# EAGLE design Hall Effect Sensor (EAGLE 7.1.0)
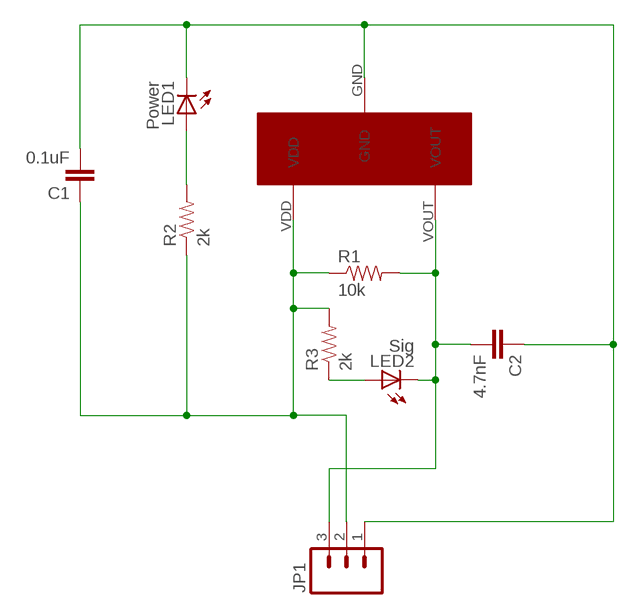
[diagram p0: schematic, sheet 1]

## Parts
C1  0.1uF  CAP0603-CAP  [0603-CAP]
C2  4.7nF  CAP0603-CAP  [0603-CAP]
JP1  M03PTH  [1X03]
LED1  Power  LED0603  [LED-0603]
LED2  Sig  LED0603  [LED-0603]
R1  10k  RESISTOR0603-RES  [0603-RES]
R2  2k  RESISTOR0603-RES  [0603-RES]
R3  2k  RESISTOR0603-RES  [0603-RES]
U$1  US5881-HALL-EFFECT  [US5881-HALL-EFFECT]

## Nets
N$2: C1.2 C2.1 JP1.1 LED1.C U$1.GND
N$3: C2.2 JP1.3 LED2.C R1.2 U$1.VOUT
N$6: LED1.A R2.2
N$7: LED2.A R3.1
VDD: C1.1 JP1.2 R1.1 R2.1 R3.2 U$1.VDD

## Library data of the parts
C1 C2 = SparkFun-Passives:CAP: Capacitor Standard 0603 ceramic capacitor, and 0.1" leaded capacitor.
JP1 = SparkFun-Connectors:M03: Header 3 Standard 3-pin 0.1" header. Use with straight break away headers (SKU : PRT-00116), right angle break away headers (PRT-00553), swiss pins (PRT-00743), machine pins (PRT-00117), and female headers (PRT-00115). Molex polarized connector foot print use with SKU : PRT-08232 with associated crimp pins and housings.
LED1 LED2 = SparkFun-LED:LED: LEDs Standard schematic elements and footprints for 5mm, 3mm, 1206, and 0603 sized LEDs. 5mm - Spark Fun Electronics SKU : COM-00529 (and others)
R1-R3 = SparkFun-Passives:RESISTOR: Resistor Basic schematic elements and footprints for 0603, 1206, and PTH resistors.
U$1 = TPS5430:US5881-HALL-EFFECT

## Board
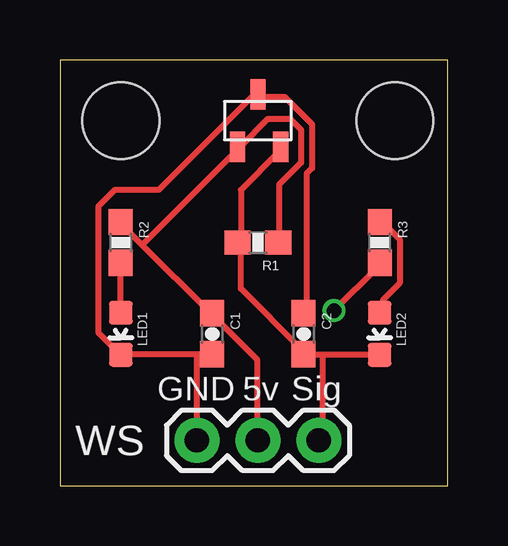
[diagram p1: board, top side]
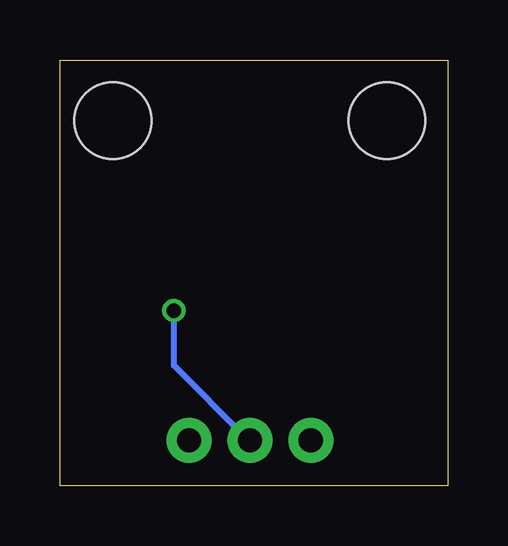
[diagram p2: board, bottom side, seen from below]

Size 16.18 x 17.77 mm. Coordinates in mm from the lower left corner, seen from the top.
Outline: 0,0 16.18,0 16.18,17.77 0,17.77 0,0
Copper layers (1*16): Top 0.0356mm / dielectric 1.5011mm / Bottom 0.0356mm
Design rules "LaenPCBOrder": minimum track width 6mil, minimum drill 13mil, track to track 6mil, track to pad 6mil, pad to pad 6mil, via to via 6mil, smd to smd 6mil, copper to edge 15mil, drill to drill 6mil, minimum pad ring 7mil, minimum via ring 7mil, stop-mask expansion 3mil, vias tented up to drill 0mil, thermal gap 10mil
Holes 3.2 mm at 2.54,15.24 13.97,15.24

### Footprints (pad centres in the part's own frame; a part is rotated, then mirrored left to right if it is on the bottom)
0603-CAP = smd 1.1 x 1: 1 -0.85,0; 2 0.85,0
1X03 = drill 1.016 pad 1.88: 1 0,0; 2 2.54,0; 3 5.08,0
LED-0603 = smd 1 x 1: A 0,-0.877; C 0,0.877
0603-RES = smd 1.1 x 1: 1 -0.85,0; 2 0.85,0
US5881-HALL-EFFECT = smd 0.635 x 1.27: GND 0,1.1; VDD -0.85,-1.1; VOUT 0.95,-1.1

### Placement (x,y rotation side)
C1  6.35,6.35 270 top
C2  10.16,6.35 270 top
JP1  5.71,1.91 0 top
LED1  2.54,6.35 180 top
LED2  13.34,6.35 180 top
R1  8.26,10.16 180 top
R2  2.54,10.16 270 top
R3  13.34,10.16 270 top
U$1  8.26,15.24 0 top

### Tracks (layer width: path | path; a pad name or v marks a point on that pad's centre or on a via)
N$2
  Top 0.254: 5.71,5.49 6.17,5.49 C1.2 | 5.71,5.49 2.74,5.49 LED1.C 2.52,5.49 1.6,6.4 1.6,11.66 2.29,12.34 4.12,12.34 8.23,16.46 U$1.GND 8.46,16.23 9.37,16.23 10.52,15.09 10.52,13.26 10.29,13.03 10.29,7.32 C2.1 | JP1.1 5.71,5.49
N$3
  Top 0.254: U$1.VOUT 9.14,13.95 7.54,12.34 7.54,10.29 R1.2 7.54,10.06 7.54,8.23 10.06,5.71 C2.2 10.29,5.49 10.97,5.49 | 10.97,5.49 13.26,5.49 LED2.C | 10.97,5.49 10.97,2.06 JP1.3
N$6
  Top 0.254: LED1.A 2.52,7.32 2.52,9.14 R2.2
N$7
  Top 0.254: LED2.A 13.49,7.32 13.49,7.77 14.17,8.46 14.17,10.29 13.49,10.97 R3.1
VDD  (via drill 0.61)
  Top 0.254: R1.1 9.14,10.29 9.14,12.57 10.06,13.49 10.06,14.86 9.6,15.32 8.69,15.32 7.54,14.17 U$1.VDD 7.32,13.95 3.43,10.06 | 3.43,10.06 2.52,10.97 R2.1 | 3.43,10.06 6.17,7.32 C1.1 6.4,7.09 8.23,5.26 8.23,2.06 JP1.2 | v11.43,7.32 13.26,9.14 R3.2
  Bottom 0.254: v11.43,7.32 11.43,5.03 8.46,2.06 JP1.2

### Text on the board
tPlace: GND | 5v | Sig | WS